# Altium schematic sheet Sheet1.SchDoc
size A3
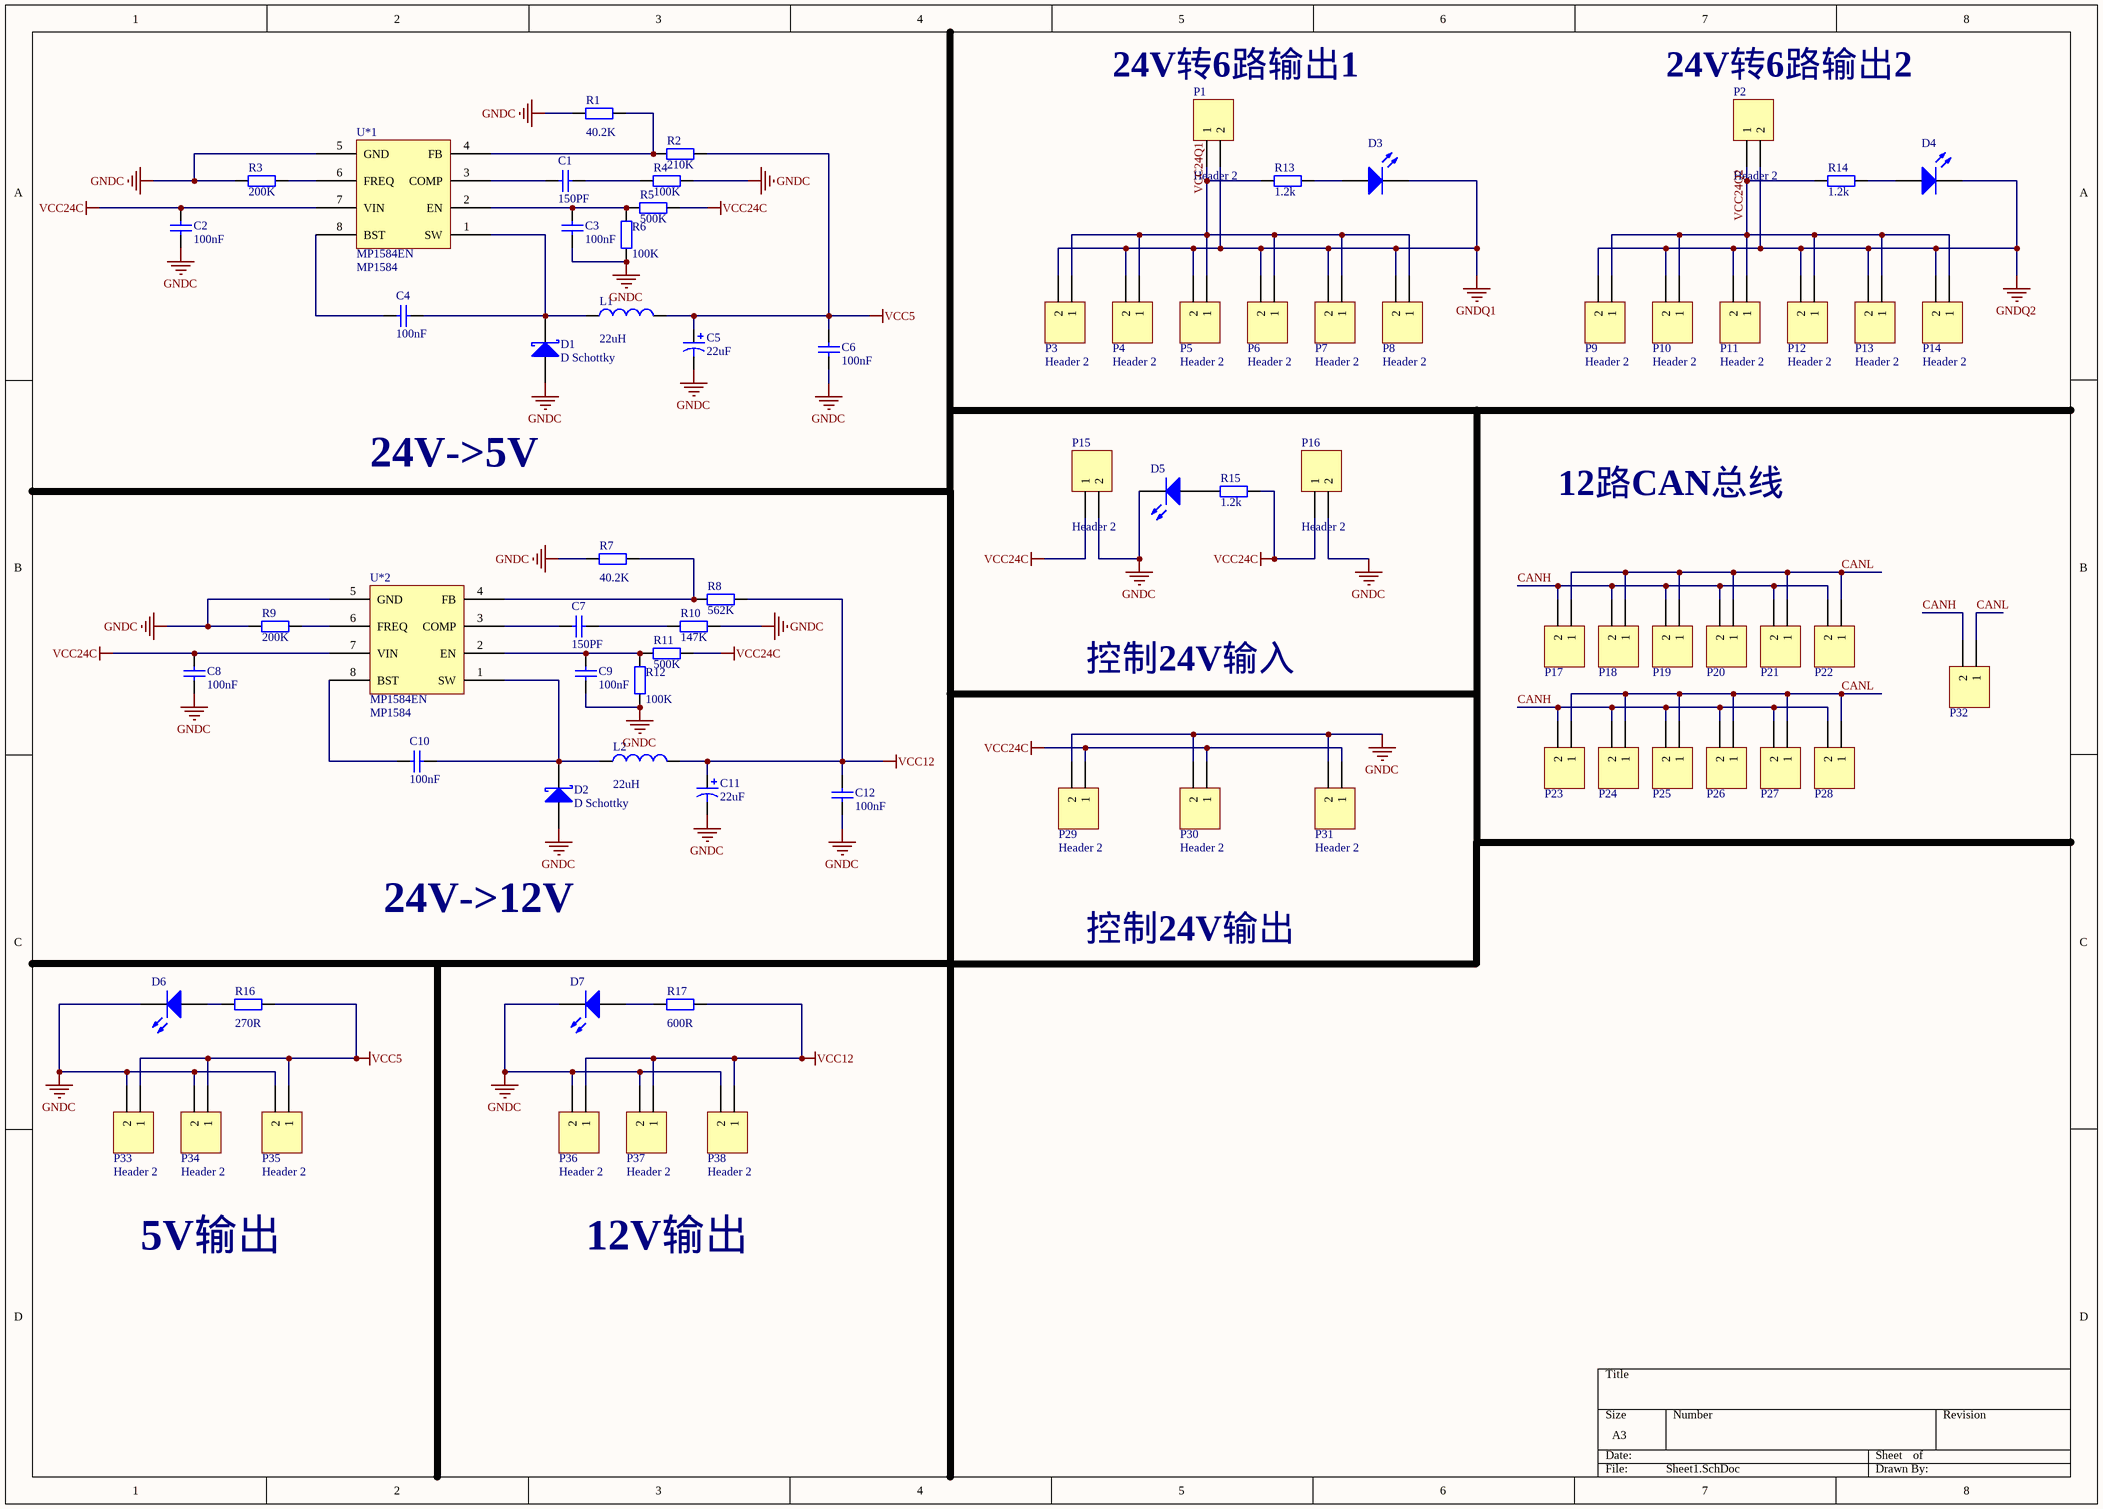
[diagram p0: Sheet1.SchDoc]

## Parts
C1  value 150PF  [0603]  (hidden comment: Cap)
C2  value 100nF  [0603]  (hidden comment: Cap)
C3  value 100nF  [0603]  (hidden comment: Cap)
C4  value 100nF  [0603]  (hidden comment: Cap)
C5  value 22uF  [CAP_RVT1E220M0505]  (hidden comment: Cap Pol3)
C6  value 100nF  [0603]  (hidden comment: Cap)
C7  value 150PF  [0603]  (hidden comment: Cap)
C8  value 100nF  [0603]  (hidden comment: Cap)
C9  value 100nF  [0603]  (hidden comment: Cap)
C10  value 100nF  [0603]  (hidden comment: Cap)
C11  value 22uF  [CAP_RVT1E220M0505]  (hidden comment: Cap Pol3)
C12  value 100nF  [0603]  (hidden comment: Cap)
D1  D Schottky  [LC-SMB(DO-214AA)_S2]
D2  D Schottky  [LC-SMB(DO-214AA)_S2]
D3  LED0  [0603]  (value not drawn)
D4  LED0  [0603]  (value not drawn)
D5  LED0  [0603]  (value not drawn)
D6  LED0  [0603]  (value not drawn)
D7  LED0  [0603]  (value not drawn)
L1  value 22uH  [JSHC0650H220M]  (hidden comment: Inductor)
L2  value 22uH  [JSHC0650H220M]  (hidden comment: Inductor)
P1  Header 2  [TX60-LI-S]
P2  Header 2  [TX60-LI-S]
P3  Header 2  [XT30_LI]
P4  Header 2  [XT30_LI]
P5  Header 2  [XT30_LI]
P6  Header 2  [XT30_LI]
P7  Header 2  [XT30_LI]
P8  Header 2  [XT30_LI]
P9  Header 2  [XT30_LI]
P10  Header 2  [XT30_LI]
P11  Header 2  [XT30_LI]
P12  Header 2  [XT30_LI]
P13  Header 2  [XT30_LI]
P14  Header 2  [XT30_LI]
P15  Header 2  [TX60-LI-S]
P16  Header 2  [TX60-LI-S]
P17  Header 2  [GH1.25_2P]  (value not drawn)
P18  Header 2  [GH1.25_2P]  (value not drawn)
P19  Header 2  [GH1.25_2P]  (value not drawn)
P20  Header 2  [GH1.25_2P]  (value not drawn)
P21  Header 2  [GH1.25_2P]  (value not drawn)
P22  Header 2  [GH1.25_2P]  (value not drawn)
P23  Header 2  [GH1.25_2P]  (value not drawn)
P24  Header 2  [GH1.25_2P]  (value not drawn)
P25  Header 2  [GH1.25_2P]  (value not drawn)
P26  Header 2  [GH1.25_2P]  (value not drawn)
P27  Header 2  [GH1.25_2P]  (value not drawn)
P28  Header 2  [GH1.25_2P]  (value not drawn)
P29  Header 2  [XT30_LI]
P30  Header 2  [XT30_LI]
P31  Header 2  [XT30_LI]
P32  Header 2  [GH1.25_2P]  (value not drawn)
P33  Header 2  [XT30_LI]
P34  Header 2  [XT30_LI]
P35  Header 2  [XT30_LI]
P36  Header 2  [XT30_LI]
P37  Header 2  [XT30_LI]
P38  Header 2  [XT30_LI]
R1  value 40.2K  [0603]  (hidden comment: Res2)
R2  value 210K  [0603]  (hidden comment: Res2)
R3  value 200K  [0603]  (hidden comment: Res2)
R4  value 100K  [0603]  (hidden comment: Res2)
R5  value 500K  [0603]  (hidden comment: Res2)
R6  value 100K  [0603]  (hidden comment: Res2)
R7  value 40.2K  [0603]  (hidden comment: Res2)
R8  value 562K  [0603]  (hidden comment: Res2)
R9  value 200K  [0603]  (hidden comment: Res2)
R10  value 147K  [0603]  (hidden comment: Res2)
R11  value 500K  [0603]  (hidden comment: Res2)
R12  value 100K  [0603]  (hidden comment: Res2)
R13  value 1.2k  [0603]  (hidden comment: Res2)
R14  value 1.2k  [0603]  (hidden comment: Res2)
R15  value 1.2k  [0603]  (hidden comment: Res2)
R16  value 270R  [0603]  (hidden comment: Res2)
R17  value 600R  [0603]  (hidden comment: Res2)
U*1  MP1584  [MP1584EN_SOIC8E]
U*2  MP1584  [MP1584EN_SOIC8E]

## Nets
GNDC: C2.1 C3.1 C5.2 C6.1 C8.1 C9.1 C11.2 C12.1 D1.1(A) D2.1(A) D5.2(K) D6.2(K) D7.2(K) P15.2 P16.2 P29.2 P30.2 P31.2 P33.2 P34.2 P35.2 P36.2 P37.2 P38.2 R1.2 R3.2 R4.1 R6.1 R7.2 R9.2 R10.1 R12.1 U*1.5(GND) U*2.5(GND)
GNDQ1: D3.2(K) P1.2 P3.2 P4.2 P5.2 P6.2 P7.2 P8.2
GNDQ2: D4.2(K) P2.2 P9.2 P10.2 P11.2 P12.2 P13.2 P14.2
VCC5: C5.1 C6.2 L1.2 P33.1 P34.1 P35.1 R2.1 R16.1
VCC12: C11.1 C12.2 L2.2 P36.1 P37.1 P38.1 R8.1 R17.1
VCC24C: C2.2 C8.2 P15.1 P16.1 P29.1 P30.1 P31.1 R5.1 R11.1 R15.1 U*1.7(VIN) U*2.7(VIN)
CANH: P17.2 P18.2 P19.2 P20.2 P21.2 P22.2 P23.2 P24.2 P25.2 P26.2 P27.2 P28.2 P32.2
CANL: P17.1 P18.1 P19.1 P20.1 P21.1 P22.1 P23.1 P24.1 P25.1 P26.1 P27.1 P28.1 P32.1
VCC24Q1: P1.1 P3.1 P4.1 P5.1 P6.1 P7.1 P8.1 R13.1
VCC24Q2: P2.1 P9.1 P10.1 P11.1 P12.1 P13.1 P14.1 R14.1
NetC1_1: C1.1 R4.2
NetC1_2: C1.2 U*1.3(COMP)
NetC3_2: C3.2 R5.2 R6.2 U*1.2(EN)
NetC4_1: C4.1 D1.2(K) L1.1 U*1.1(SW)
NetC4_2: C4.2 U*1.8(BST)
NetC7_1: C7.1 R10.2
NetC7_2: C7.2 U*2.3(COMP)
NetC9_2: C9.2 R11.2 R12.2 U*2.2(EN)
NetC10_1: C10.1 D2.2(K) L2.1 U*2.1(SW)
NetC10_2: C10.2 U*2.8(BST)
NetD3_1: D3.1(A) R13.2
NetD4_1: D4.1(A) R14.2
NetD5_1: D5.1(A) R15.2
NetD6_1: D6.1(A) R16.2
NetD7_1: D7.1(A) R17.2
NetR1_1: R1.1 R2.2 U*1.4(FB)
NetR3_1: R3.1 U*1.6(FREQ)
NetR7_1: R7.1 R8.2 U*2.4(FB)
NetR9_1: R9.1 U*2.6(FREQ)

## Notes on the sheet
- 24V转6路输出1
- 24V转6路输出2
- 24V->5V
- 12路CAN总线
- 控制24V输入
- 24V->12V
- 控制24V输出
- 5V输出
- 12V输出
- (in symbol MP1584) MP1584EN

## Library data of the parts
C1-C4 C6-C10 C12 = Cap: Capacitor; Published: 8-Jun-2000; LatestRevisionDate: 17-Jul-2002; LatestRevisionNote: Re-released for DXP Platform.; PackageReference: RAD-0.3; Publisher: Altium Limited; PackageDescription: Radial Cap, Thru-Hole; 2 Leads; 0.3 in Pin Spacing
C5 C11 = Cap Pol3: Polarized Capacitor (Surface Mount); Published: 8-Jun-2000; LatestRevisionDate: 29-May-2009; LatestRevisionNote: IPC-7351 Footprint Added.; PackageReference: C0805; Publisher: Altium Limited; PackageDescription: Chip Capacitor
D1 D2 = D Schottky: Schottky Diode; Published: 8-Jun-2000; LatestRevisionDate: 17-Jul-2002; LatestRevisionNote: Re-released for DXP Platform.; PackageReference: SMB; Publisher: Altium Limited; PackageDescription: DO-214-AA/SMB; 2 C-Bend Leads; Body 5.3 x 3.6 mm, inc. leads (LxW); Code_JEDEC: DO-214-AA
D3-D7 = LED0: Typical INFRARED GaAs LED; Published: 8-Jun-2000; LatestRevisionDate: 08-Jul-2005; LatestRevisionNote: Mech Layer 1 removed.; PackageReference: LED-0; Publisher: Altium Limited; PackageDescription: LED; 2 Leads
L1 L2 = Inductor: Code_IEC: 1005; Published: 8-Jun-2000; LatestRevisionDate: 29-May-2009; LatestRevisionNote: IPC-7351 Footprint Added.; PackageReference: 0402-A; Publisher: Altium Limited; PackageDescription: Chip Inductor; Code_JEITA: 0402
P1-P38 = Header 2: Header, 2-Pin; LatestRevisionDate: 17-Jul-2002; LatestRevisionNote: Re-released for DXP Platform.; Publisher: Altium Limited
R1-R17 = Res2: Resistor; Published: 8-Jun-2000; LatestRevisionDate: 17-Jul-2002; LatestRevisionNote: Re-released for DXP Platform.; PackageReference: AXIAL-0.4; Publisher: Altium Limited; PackageDescription: Axial Device, Thru-Hole; 2 Leads; 0.4 in Pin Spacing